# EAGLE schematic WeMos32Proto (EAGLE 8.6.0)
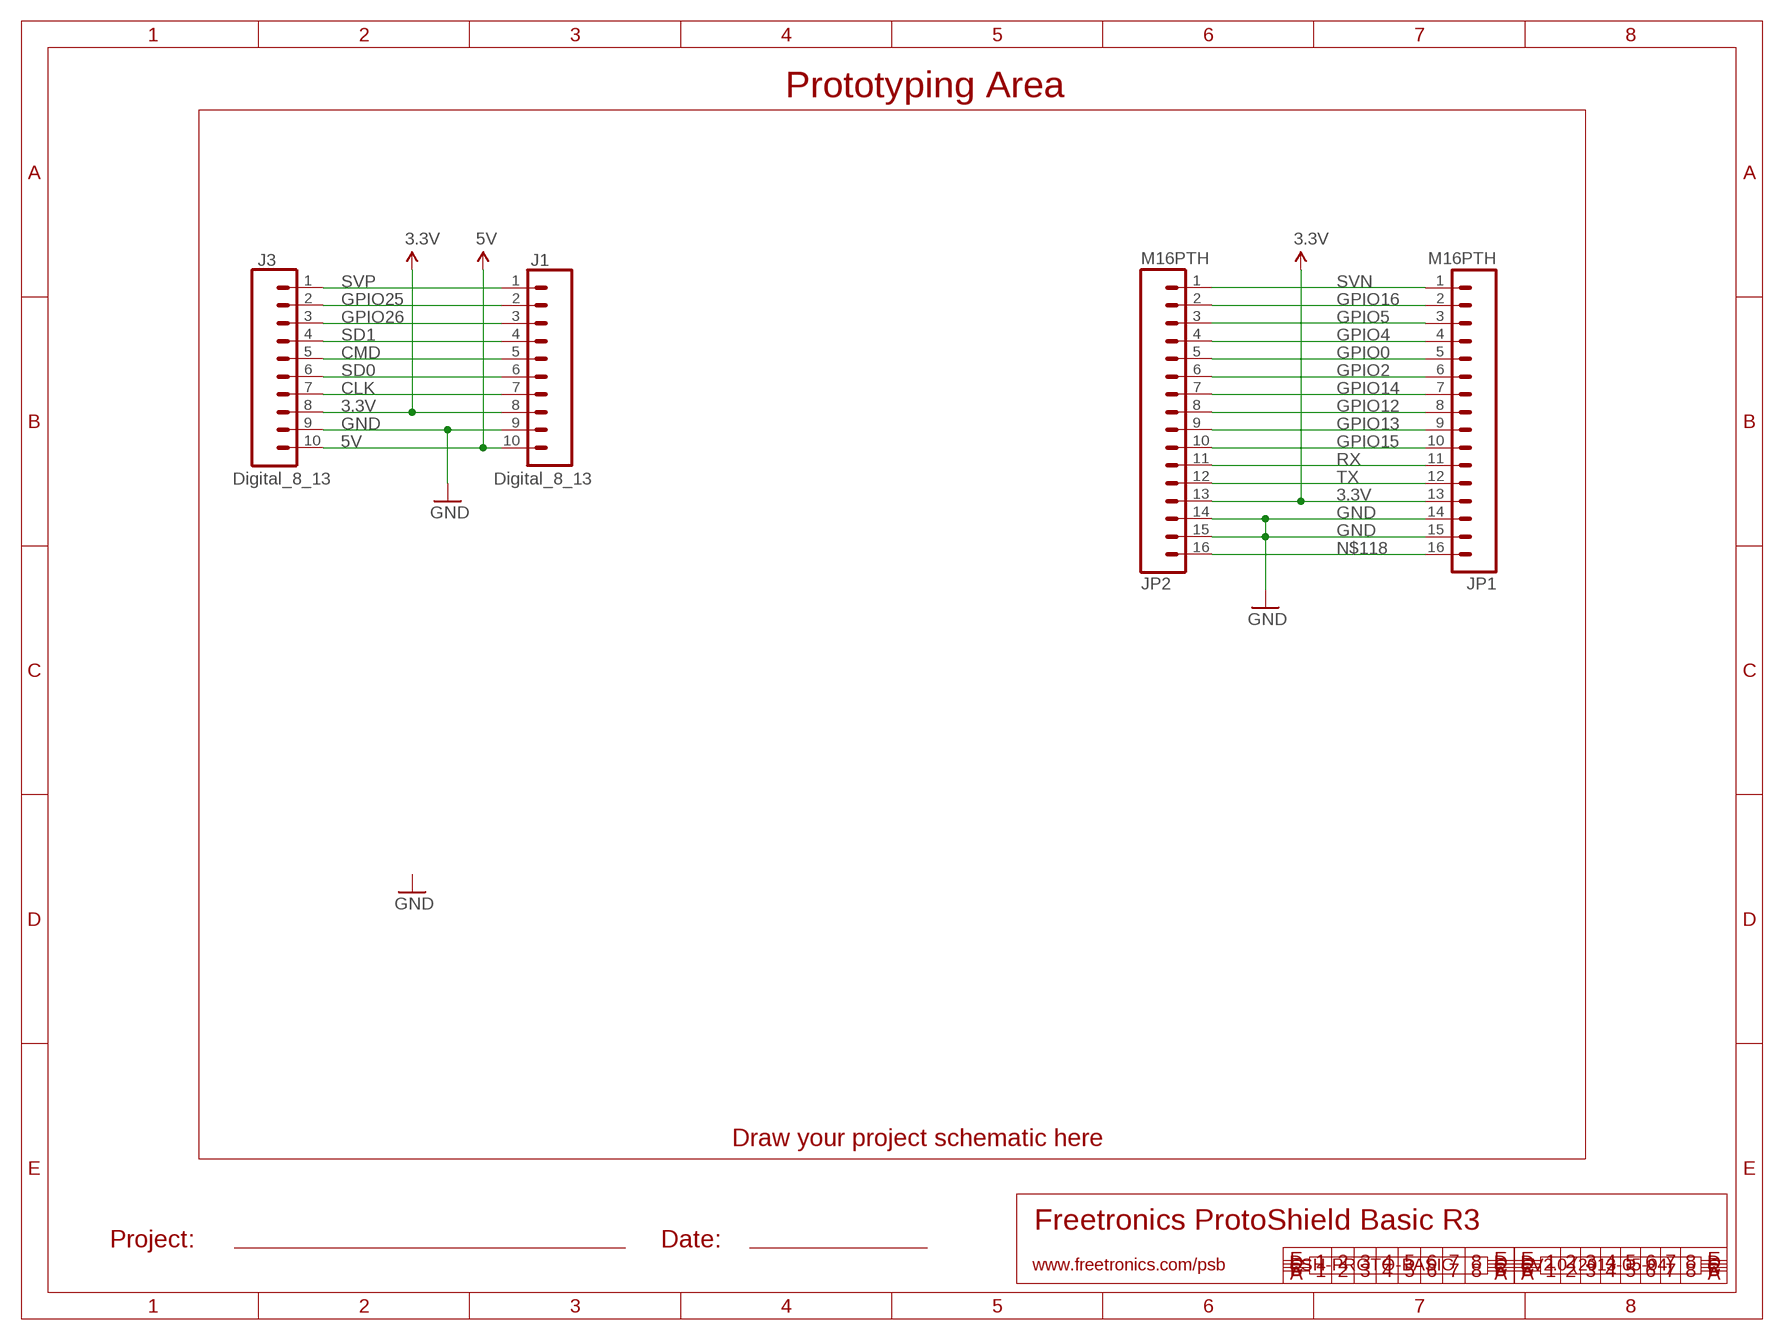
[diagram p0: schematic, sheet 1]

## Parts
J1  Digital_8_13  M100.1  [1X10]
J3  Digital_8_13  M100.1  [1X10]
JP1  M16PTH  [1X16]
JP2  M16PTH  [1X16]

## Nets
3.3V: J1.8 J3.8 JP1.13 JP2.13
5V: J1.10 J3.10
CLK: J1.7 J3.7
CMD: J1.5 J3.5
GND: J1.9 J3.9 JP1.14 JP1.15 JP2.14 JP2.15
GPIO0: JP1.5 JP2.5
GPIO2: JP1.6 JP2.6
GPIO4: JP1.4 JP2.4
GPIO5: JP1.3 JP2.3
GPIO12: JP1.8 JP2.8
GPIO13: JP1.9 JP2.9
GPIO14: JP1.7 JP2.7
GPIO15: JP1.10 JP2.10
GPIO16: JP1.2 JP2.2
GPIO25: J1.2 J3.2
GPIO26: J1.3 J3.3
N$118: JP1.16 JP2.16
RX: JP1.11 JP2.11
SD0: J1.6 J3.6
SD1: J1.4 J3.4
SVN: JP1.1 JP2.1
SVP: J1.1 J3.1
TX: JP1.12 JP2.12

## Notes on the sheet
- Prototyping Area
- Draw your project schematic here
- Freetronics ProtoShield Basic R3
- Project: | Date:
- www.freetronics.com/psb | SH-PROTO-BASIC | V2.0 (2013-05-04)

## Library data of the parts
J1 J3 = freetronics-original:M10: Header 10 Standard 10-pin 0.1" header. Use with straight break away headers (SKU : PRT-00116), right angle break away headers (PRT-00553), swiss pins (PRT-00743), machine pins (PRT-00117), and female headers (PRT-00115).
JP1 JP2 = freetronics-jon:M16